# Altium schematic sheet DHQ11.SchDoc
size A4
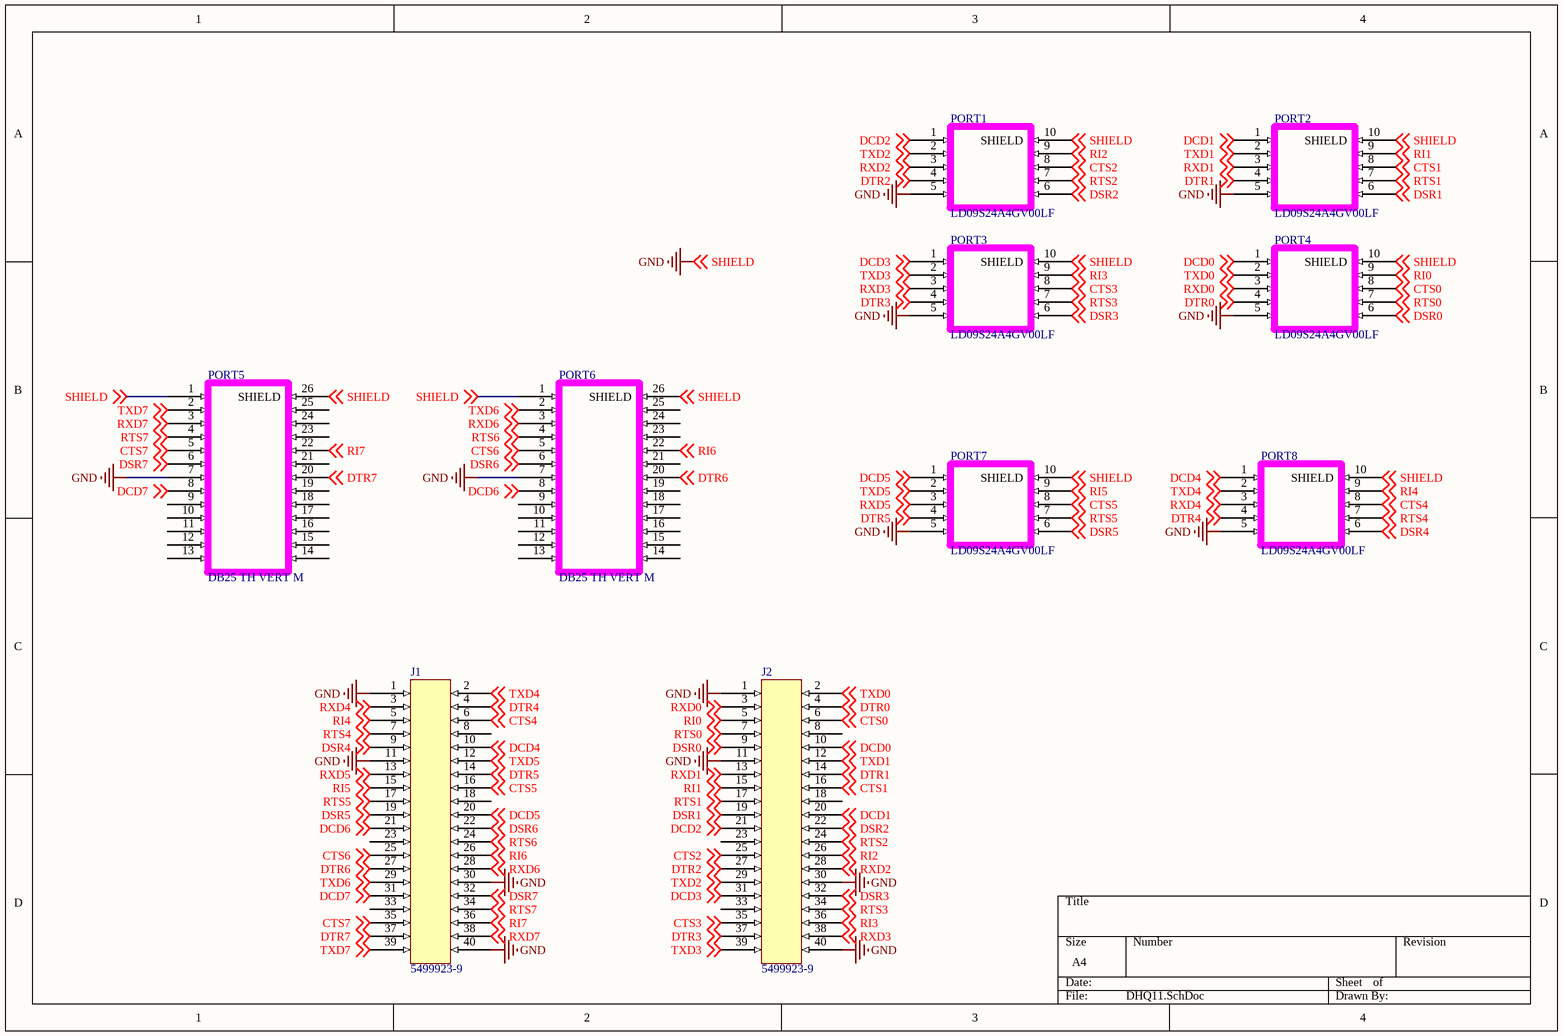
[diagram p0: DHQ11.SchDoc]

## Parts
J1  5499923-9  [HDR2X20 Ejector]
J2  5499923-9  [HDR2X20 Ejector]
PORT1  LD09S24A4GV00LF  [LD09S24A4GV00LF]
PORT2  LD09S24A4GV00LF  [LD09S24A4GV00LF]
PORT3  LD09S24A4GV00LF  [LD09S24A4GV00LF]
PORT4  LD09S24A4GV00LF  [LD09S24A4GV00LF]
PORT5  DB25 TH VERT M  [D25P24A6GV00LF]
PORT6  DB25 TH VERT M  [D25P24A6GV00LF]
PORT7  LD09S24A4GV00LF  [LD09S24A4GV00LF]
PORT8  LD09S24A4GV00LF  [LD09S24A4GV00LF]

## Nets
GND: J1.1 J1.11 J1.30 J1.40 J2.1 J2.11 J2.30 J2.40 PORT1.5 PORT1.10(SHIELD) PORT2.5 PORT2.10(SHIELD) PORT3.5 PORT3.10(SHIELD) PORT4.5 PORT4.10(SHIELD) PORT5.1 PORT5.7 PORT5.26(SHIELD) PORT6.1 PORT6.7 PORT6.26(SHIELD) PORT7.5 PORT7.10(SHIELD) PORT8.5 PORT8.10(SHIELD) ; off-sheet SHIELD  [also labelled SHIELD]
CTS0: J2.6 PORT4.8 ; off-sheet CTS0
CTS1: J2.16 PORT2.8 ; off-sheet CTS1
CTS2: J2.25 PORT1.8 ; off-sheet CTS2
CTS3: J2.35 PORT3.8 ; off-sheet CTS3
CTS4: J1.6 PORT8.8 ; off-sheet CTS4
CTS5: J1.16 PORT7.8 ; off-sheet CTS5
CTS6: J1.25 PORT6.5 ; off-sheet CTS6
CTS7: J1.35 PORT5.5 ; off-sheet CTS7
DCD0: J2.10 PORT4.1 ; off-sheet DCD0
DCD1: J2.20 PORT2.1 ; off-sheet DCD1
DCD2: J2.21 PORT1.1 ; off-sheet DCD2
DCD3: J2.31 PORT3.1 ; off-sheet DCD3
DCD4: J1.10 PORT8.1 ; off-sheet DCD4
DCD5: J1.20 PORT7.1 ; off-sheet DCD5
DCD6: J1.21 PORT6.8 ; off-sheet DCD6
DCD7: J1.31 PORT5.8 ; off-sheet DCD7
DSR0: J2.9 PORT4.6 ; off-sheet DSR0
DSR1: J2.19 PORT2.6 ; off-sheet DSR1
DSR2: J2.22 PORT1.6 ; off-sheet DSR2
DSR3: J2.32 PORT3.6 ; off-sheet DSR3
DSR4: J1.9 PORT8.6 ; off-sheet DSR4
DSR5: J1.19 PORT7.6 ; off-sheet DSR5
DSR6: J1.22 PORT6.6 ; off-sheet DSR6
DSR7: J1.32 PORT5.6 ; off-sheet DSR7
DTR0: J2.4 PORT4.4 ; off-sheet DTR0
DTR1: J2.14 PORT2.4 ; off-sheet DTR1
DTR2: J2.27 PORT1.4 ; off-sheet DTR2
DTR3: J2.37 PORT3.4 ; off-sheet DTR3
DTR4: J1.4 PORT8.4 ; off-sheet DTR4
DTR5: J1.14 PORT7.4 ; off-sheet DTR5
DTR6: J1.27 PORT6.20 ; off-sheet DTR6
DTR7: J1.37 PORT5.20 ; off-sheet DTR7
RI0: J2.5 PORT4.9 ; off-sheet RI0
RI1: J2.15 PORT2.9 ; off-sheet RI1
RI2: J2.26 PORT1.9 ; off-sheet RI2
RI3: J2.36 PORT3.9 ; off-sheet RI3
RI4: J1.5 PORT8.9 ; off-sheet RI4
RI5: J1.15 PORT7.9 ; off-sheet RI5
RI6: J1.26 PORT6.22 ; off-sheet RI6
RI7: J1.36 PORT5.22 ; off-sheet RI7
RTS0: J2.7 PORT4.7 ; off-sheet RTS0
RTS1: J2.17 PORT2.7 ; off-sheet RTS1
RTS2: J2.24 PORT1.7 ; off-sheet RTS2
RTS3: J2.34 PORT3.7 ; off-sheet RTS3
RTS4: J1.7 PORT8.7 ; off-sheet RTS4
RTS5: J1.17 PORT7.7 ; off-sheet RTS5
RTS6: J1.24 PORT6.4 ; off-sheet RTS6
RTS7: J1.34 PORT5.4 ; off-sheet RTS7
RXD0: J2.3 PORT4.3 ; off-sheet RXD0
RXD1: J2.13 PORT2.3 ; off-sheet RXD1
RXD2: J2.28 PORT1.3 ; off-sheet RXD2
RXD3: J2.38 PORT3.3 ; off-sheet RXD3
RXD4: J1.3 PORT8.3 ; off-sheet RXD4
RXD5: J1.13 PORT7.3 ; off-sheet RXD5
RXD6: J1.28 PORT6.3 ; off-sheet RXD6
RXD7: J1.38 PORT5.3 ; off-sheet RXD7
TXD0: J2.2 PORT4.2 ; off-sheet TXD0
TXD1: J2.12 PORT2.2 ; off-sheet TXD1
TXD2: J2.29 PORT1.2 ; off-sheet TXD2
TXD3: J2.39 PORT3.2 ; off-sheet TXD3
TXD4: J1.2 PORT8.2 ; off-sheet TXD4
TXD5: J1.12 PORT7.2 ; off-sheet TXD5
TXD6: J1.29 PORT6.2 ; off-sheet TXD6
TXD7: J1.39 PORT5.2 ; off-sheet TXD7

Not connected (* = marked no-connect by the designer): J1 8 18 23 33; J2 8 18 23 33; PORT5 9 10 11 12 13 14 15 16 17 18 19 21 23 24 25; PORT6 9 10 11 12 13 14 15 16 17 18 19 21 23 24 25

## Library data of the parts
J1 J2 = 5499923-9: 2X20 Latch VERT HDR M TH; P/N: 5499923-9
PORT1-PORT4 PORT7 PORT8 = DB9 VERT TH M: P/N: LD09S24A4GV00LF
PORT5 PORT6 = DB25 TH VERT M: P/N: L717TSBH25POL2RM8